# EAGLE design V4-AddOnZigbee-DIL-V001 (EAGLE 9.3.0)
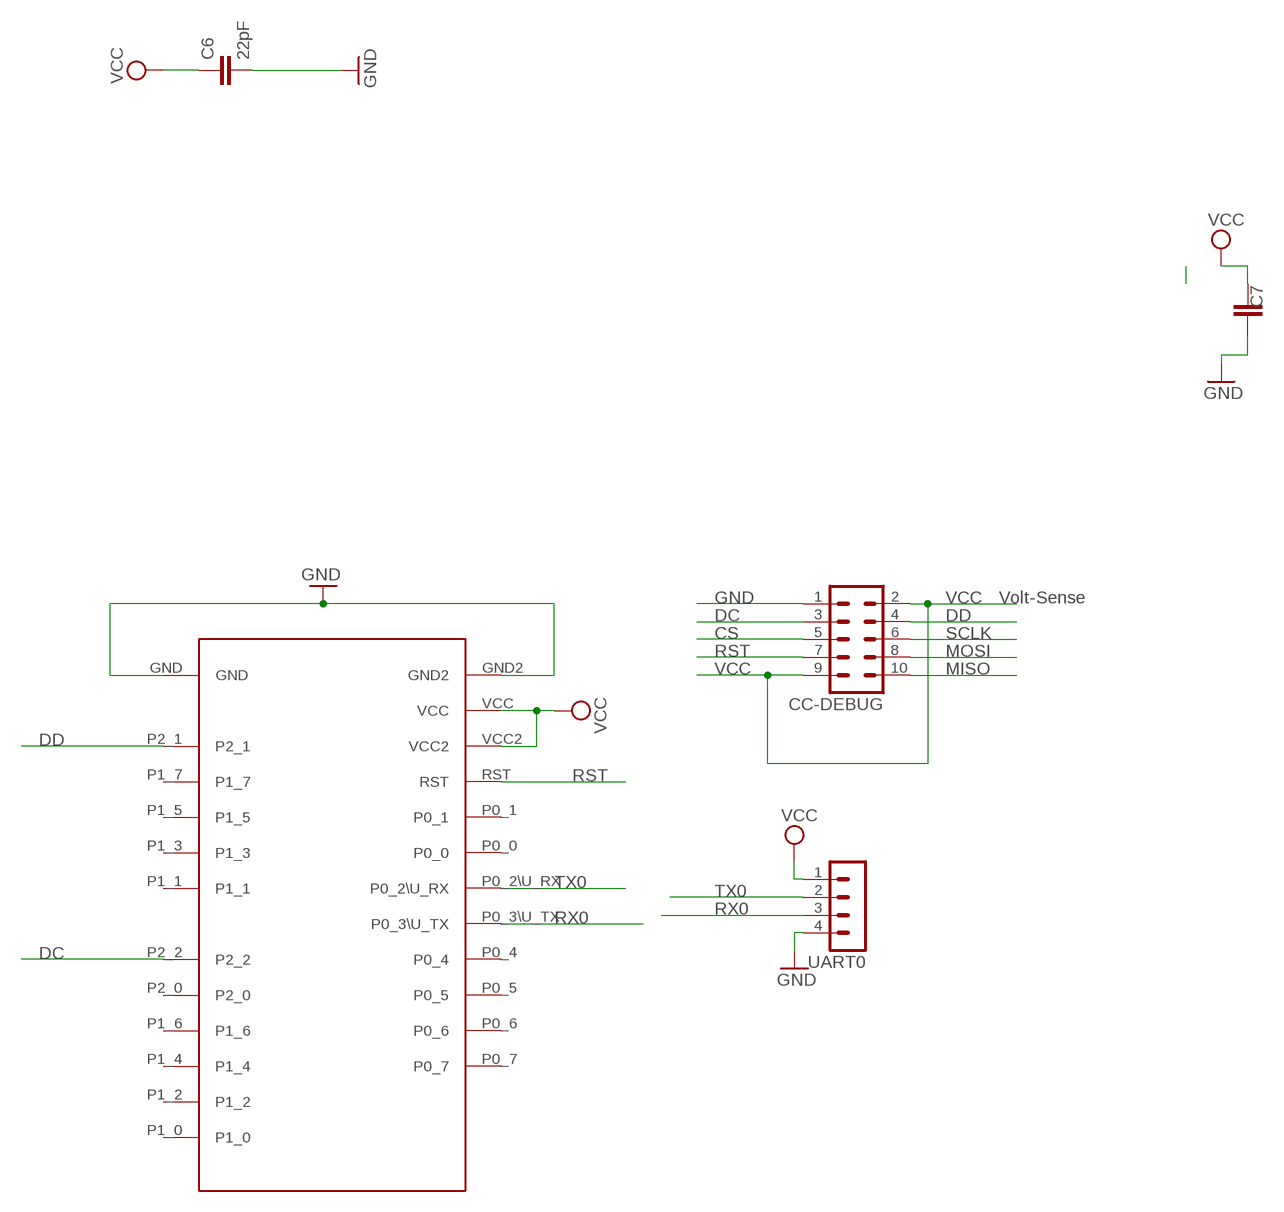
[diagram p0: schematic, sheet 1]

## Parts
C6  22pF  C-EUC0805  [C0805]
C7  C-EUC1812  [C1812]
CC-DEBUG  MA05-2  [MA05-2]
U$3  CC2530_MODULE  [CC2530_DIL]
UART0  MA04-1  [MA04-1]

## Nets
CS: CC-DEBUG.5
DC: CC-DEBUG.3 U$3.P2_2
DD: CC-DEBUG.4 U$3.P2_1
GND [PWR]: C6.2 C7.1 CC-DEBUG.1 U$3.GND U$3.GND2 UART0.4
MISO: CC-DEBUG.10
MOSI: CC-DEBUG.8
RST: CC-DEBUG.7 U$3.RST
RX0: U$3.P0_3\U_TX UART0.3
SCLK: CC-DEBUG.6
TX0: U$3.P0_2\U_RX UART0.2
VCC [PWR]: C6.1 C7.2 CC-DEBUG.2 CC-DEBUG.9 U$3.VCC U$3.VCC2 UART0.1
Unconnected: U$3.P0_0 U$3.P0_1 U$3.P0_4 U$3.P0_5 U$3.P0_6 U$3.P0_7 U$3.P1_0 U$3.P1_1 U$3.P1_2 U$3.P1_3 U$3.P1_4 U$3.P1_5 U$3.P1_6 U$3.P1_7 U$3.P2_0

## Notes on the sheet
- Volt-Sense

## Library data of the parts
C6 C7 = rcl:C-EU: CAPACITOR, European symbol; SPICEPREFIX: C
CC-DEBUG = con-lstb:MA05-2: PIN HEADER; OC_FARNELL: unknown; OC_NEWARK: unknown
U$3 = Martin-Communication-V4:CC2530_MODULE
UART0 = con-lstb:MA04-1: PIN HEADER; OC_FARNELL: unknown; OC_NEWARK: unknown

## Net classes
0 default: width 0.305 mm
1 PWR: width 0.61 mm

## Board
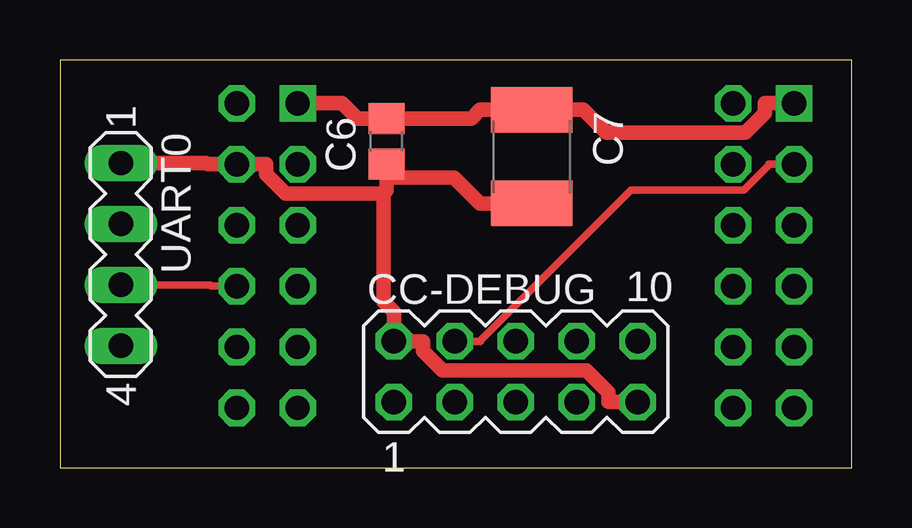
[diagram p1: board, top side]
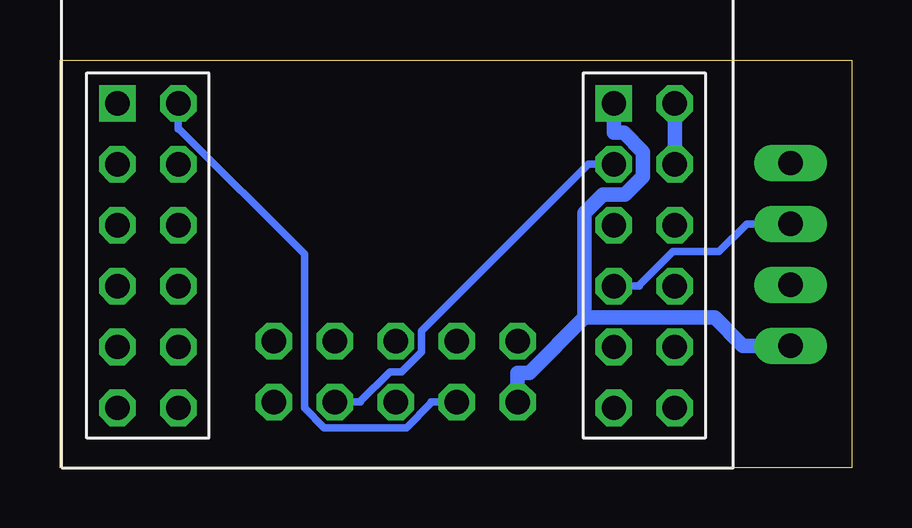
[diagram p2: board, bottom side, seen from below]

Size 33 x 17 mm. Coordinates in mm from the lower left corner, seen from the top.
Outline: 0,0 33,0 33,17 0,17 0,0
Copper layers (1*16): Top 0.035mm / dielectric 1.5mm / Bottom 0.035mm
Design rules "default": minimum track width 6mil, minimum drill 0.35mm, track to track 6mil, track to pad 6mil, pad to pad 6mil, via to via 6mil, smd to smd 6mil, copper to edge 40mil, drill to drill 6mil, minimum pad ring 10mil, minimum via ring 8mil, stop-mask expansion 4mil, vias tented up to drill 0mil, thermal gap 10mil

### Footprints (pad centres in the part's own frame; a part is rotated, then mirrored left to right if it is on the bottom)
C0805 = smd 1.3 x 1.5: 1 -0.95,0; 2 0.95,0
C1812 = smd 1.9 x 3.4: 1 -1.95,0; 2 1.95,0
MA05-2 = drill 1.016 octagon: 1 -5.08,-1.27; 2 -5.08,1.27; 3 -2.54,-1.27; 4 -2.54,1.27; 5 0,-1.27; 6 0,1.27; 7 2.54,-1.27; 8 2.54,1.27; 9 5.08,-1.27; 10 5.08,1.27
CC2530_DIL = drill 1.016 square: GND 2.316,15.19; GND2 23.017,15.19 | drill 1.016 octagon: P0_0 23.017,10.11; P0_1 25.557,10.11; P0_2\U_RX 23.017,7.57; P0_3\U_TX 25.557,7.57; P0_4 23.017,5.03; P0_5 25.557,5.03; P0_6 23.017,2.49; P0_7 25.557,2.49; P1_0 4.856,2.49; P1_1 2.316,2.49; P1_2 4.856,5.03; P1_3 2.316,5.03; P1_4 4.856,7.57; P1_5 2.316,7.57; P1_6 4.856,10.11; P1_7 2.316,10.11; P2_0 4.856,12.65; P2_1 2.316,12.65; P2_2 4.856,15.19; RST 23.017,12.65; VCC 25.557,15.19; VCC2 25.557,12.65
MA04-1 = drill 1.016 long: 1 -3.81,0; 2 -1.27,0; 3 1.27,0; 4 3.81,0

### Placement (x,y rotation side)
C6  13.61,13.61 90 top
C7  19.67,12.97 270 top
CC-DEBUG  19,4 0 top
U$3  32.92,0 0 bottom
UART0  2.54,8.89 270 top

### Tracks (layer width: path | path; a pad name or v marks a point on that pad's centre or on a via)
DC
  Bottom 0.305: CC-DEBUG.3 17.53,2.73 17.53,2.69 18.56,1.66 21.98,1.66 22.81,2.49 22.81,8.91 28.03,14.12 28.07,14.12 U$3.P2_2
DD
  Top 0.305: CC-DEBUG.4 17.53,5.27 17.53,5.31 23.8,11.58 28.52,11.58 29.54,12.61 29.54,12.65 U$3.P2_1
GND
  Top 0.61: U$3.GND2 11.76,15.19 12.4,14.55 C6.2 17.15,14.55 17.51,14.92 C7.1 21.83,14.92 22.78,13.97 28.58,13.97 29.39,14.78 29.39,15.19 U$3.GND
  Bottom 0.61: 11.13,6.25 13.43,3.95 13.92,3.95 CC-DEBUG.1 | 11.13,6.25 5.7,6.25 4.52,5.08 UART0.4 | 11.13,6.25 11.13,10.61 10.36,11.38 9.45,11.38 8.69,12.14 8.69,13.16 9.5,13.97 9.91,13.97 U$3.GND2
RST
  Bottom 0.305: CC-DEBUG.7 20.47,2.73 20.47,2.77 19.25,4 18.76,4 17.93,4.83 17.93,5.69 10.97,12.65 U$3.RST
RX0
  Top 0.305: U$3.P0_3\U_TX 6.3,7.57 6.25,7.62 UART0.3
TX0
  Bottom 0.305: U$3.P0_2\U_RX 8.84,7.57 8.84,7.61 7.45,9 5.53,9 4.37,10.16 UART0.2
VCC
  Top 0.61: 13.49,11.43 13.61,11.55 13.61,12.1 | 13.49,11.43 9.4,11.43 8.59,12.24 8.59,12.65 U$3.VCC2 6.15,12.65 6.1,12.7 UART0.1 | 13.49,11.43 13.49,6.92 13.92,6.49 CC-DEBUG.2 15.14,5.27 15.14,4.86 15.95,4.05 21.95,4.05 22.86,3.14 22.86,2.73 CC-DEBUG.9 | C7.2 17.51,11.02 16.43,12.1 13.61,12.1 | C6.1 13.61,12.1
  Bottom 0.61: U$3.VCC2 U$3.VCC